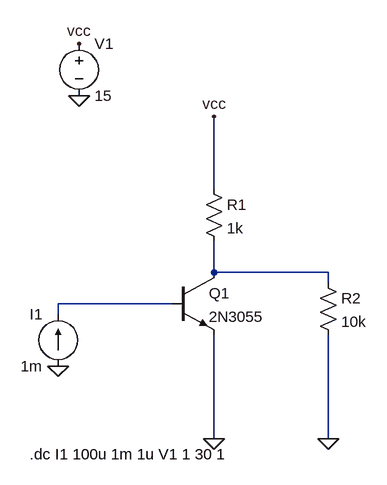
[diagram p0: schematic hfe.asc]
hfe.asc, the LTspice schematic file:
Version 4
SHEET 1 880 680
WIRE 176 -32 176 -144
WIRE 176 96 176 48
WIRE 352 96 176 96
WIRE 352 112 352 96
WIRE 112 144 -64 144
WIRE -64 160 -64 144
WIRE 176 352 176 192
WIRE 352 352 352 192
FLAG -32 -256 vcc
FLAG -32 -176 0
FLAG 176 -144 vcc
FLAG 176 352 0
FLAG -64 240 0
FLAG 352 352 0
SYMBOL npn 112 96 R0
SYMATTR InstName Q1
SYMATTR Value 2N3055
SYMBOL voltage -32 -272 R0
WINDOW 123 0 0 Left 0
WINDOW 39 0 0 Left 0
SYMATTR InstName V1
SYMATTR Value 15
SYMBOL res 160 -48 R0
SYMATTR InstName R1
SYMATTR Value 1k
SYMBOL current -64 240 R180
WINDOW 0 24 80 Left 2
WINDOW 3 24 0 Left 2
WINDOW 123 0 0 Left 0
WINDOW 39 0 0 Left 0
SYMATTR InstName I1
SYMATTR Value 1m
SYMBOL res 336 96 R0
SYMATTR InstName R2
SYMATTR Value 10k
TEXT -108 376 Left 2 !.dc I1 100u 1m 1u V1 1 30 1

The netlist it stands for:
* hfe.asc
Q1 N001 N002 0 0 2N3055
V1 vcc 0 15
R1 vcc N001 1k
I1 0 N002 1m
R2 N001 0 10k
.model NPN NPN
.model PNP PNP
.lib standard.bjt
.dc I1 100u 1m 1u V1 1 30 1
.backanno
.end